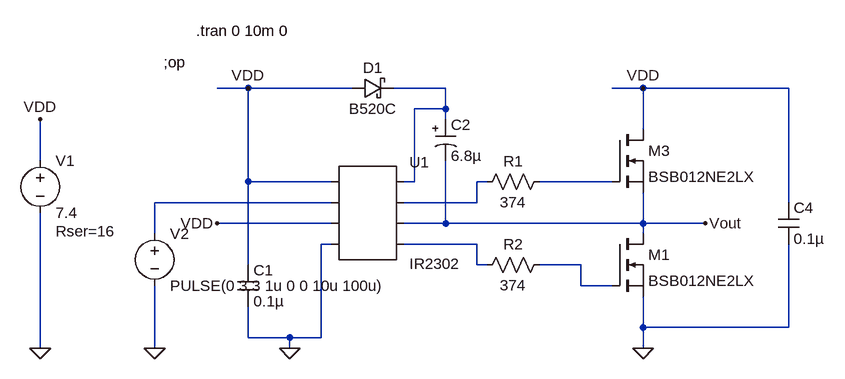
[diagram p0: schematic HBridge.asc]
HBridge.asc, the LTspice schematic file:
Version 4
SHEET 1 1400 680
WIRE -144 -32 -192 -32
WIRE 16 -32 -144 -32
WIRE 160 -32 80 -32
WIRE 464 -32 416 -32
WIRE 688 -32 464 -32
WIRE 160 0 160 -32
WIRE 160 0 112 0
WIRE 160 16 160 0
WIRE 464 32 464 -32
WIRE -464 80 -464 16
WIRE -144 112 -144 -32
WIRE -16 112 -144 112
WIRE 112 112 112 0
WIRE 112 112 96 112
WIRE 224 112 208 112
WIRE 416 112 304 112
WIRE -16 144 -288 144
WIRE 208 144 208 112
WIRE 208 144 96 144
WIRE 688 144 688 -32
WIRE -16 176 -192 176
WIRE 160 176 160 80
WIRE 160 176 96 176
WIRE 464 176 464 128
WIRE 464 176 160 176
WIRE 560 176 464 176
WIRE -288 192 -288 144
WIRE 464 192 464 176
WIRE -16 208 -32 208
WIRE 208 208 96 208
WIRE -144 240 -144 112
WIRE 208 240 208 208
WIRE 224 240 208 240
WIRE 368 240 304 240
WIRE 368 272 368 240
WIRE 416 272 368 272
WIRE 464 336 464 288
WIRE 688 336 688 208
WIRE 688 336 464 336
WIRE -144 352 -144 304
WIRE -80 352 -144 352
WIRE -32 352 -32 208
WIRE -32 352 -80 352
WIRE -464 368 -464 160
WIRE -288 368 -288 272
WIRE -80 368 -80 352
WIRE 464 368 464 336
FLAG -80 368 0
FLAG 464 368 0
FLAG -464 368 0
FLAG -464 16 VDD
FLAG 464 -32 VDD
FLAG -144 -32 VDD
FLAG -288 368 0
FLAG -192 176 VDD
FLAG 560 176 Vout
SYMBOL schottky 16 -16 R270
WINDOW 0 32 32 VTop 2
WINDOW 3 0 32 VBottom 2
SYMATTR InstName D1
SYMATTR Value B520C
SYMATTR Description Diode
SYMATTR Type diode
SYMBOL res 320 96 R90
WINDOW 0 0 56 VBottom 2
WINDOW 3 32 56 VTop 2
SYMATTR InstName R1
SYMATTR Value 374
SYMATTR SpiceLine tol=1 pwr=0.1
SYMBOL AutoGenerated\\IR2302 32 160 R0
SYMATTR InstName U1
SYMBOL res 320 224 R90
WINDOW 0 0 56 VBottom 2
WINDOW 3 32 56 VTop 2
SYMATTR InstName R2
SYMATTR Value 374
SYMATTR SpiceLine tol=1 pwr=0.1
SYMBOL nmos 416 32 R0
SYMATTR InstName M3
SYMATTR Value BSB012NE2LX
SYMBOL nmos 416 192 R0
SYMATTR InstName M1
SYMATTR Value BSB012NE2LX
SYMBOL cap -160 240 R0
SYMATTR InstName C1
SYMATTR Value 0.1µ
SYMATTR SpiceLine V=16 Irms=728m Rser=0.14361 Lser=0 mfg="KEMET" pn="C0603C104K4RAC" type="X7R"
SYMBOL polcap 144 16 R0
WINDOW 3 24 56 Left 2
SYMATTR Value 6.8µ
SYMATTR InstName C2
SYMATTR Description Capacitor
SYMATTR Type cap
SYMATTR SpiceLine V=50 Irms=1.44145 Rser=0.09 Lser=0 mfg="KEMET" pn="T521V685M050ATE090" type="Tantalum"
SYMBOL voltage -464 64 R0
WINDOW 123 0 0 Left 0
WINDOW 39 24 124 Left 2
SYMATTR SpiceLine Rser=16
SYMATTR InstName V1
SYMATTR Value 7.4
SYMBOL voltage -288 176 R0
WINDOW 123 0 0 Left 0
WINDOW 39 0 0 Left 0
SYMATTR InstName V2
SYMATTR Value PULSE(0 3.3 1u 0 0 10u 100u)
SYMBOL cap 672 144 R0
SYMATTR InstName C4
SYMATTR Value 0.1µ
SYMATTR SpiceLine V=16 Irms=728m Rser=0.14361 Lser=0 mfg="KEMET" pn="C0603C104K4RAC" type="X7R"
TEXT -224 -120 Left 2 !.tran 0 10m 0
TEXT -274 -72 Left 2 !;op

The netlist it stands for:
* HBridge.asc
D1 VDD N001 B520C
R1 N003 N002 374 tol=1 pwr=0.1
* U1: IR2302 (symbol AutoGenerated\IR2302 not available, pins judged from their places): pin1=VDD pin2=N004 pin3=VDD pin4=0 pin5=N001 pin6=N002 pin7=Vout pin8=N005
R2 N006 N005 374 tol=1 pwr=0.1
M3 VDD N003 Vout Vout BSB012NE2LX
M1 Vout N006 0 0 BSB012NE2LX
C1 VDD 0 0.1µ V=16 Irms=728m Rser=0.14361 Lser=0 mfg="KEMET" pn="C0603C104K4RAC" type="X7R"
C2 N001 Vout 6.8µ V=50 Irms=1.44145 Rser=0.09 Lser=0 mfg="KEMET" pn="T521V685M050ATE090" type="Tantalum"
V1 VDD 0 7.4 Rser=16
V2 N004 0 PULSE(0 3.3 1u 0 0 10u 100u)
C4 VDD 0 0.1µ V=16 Irms=728m Rser=0.14361 Lser=0 mfg="KEMET" pn="C0603C104K4RAC" type="X7R"
.model D D
.lib standard.dio
.model NMOS NMOS
.model PMOS PMOS
.lib standard.mos
.tran 0 10m 0
;op
.backanno
.end